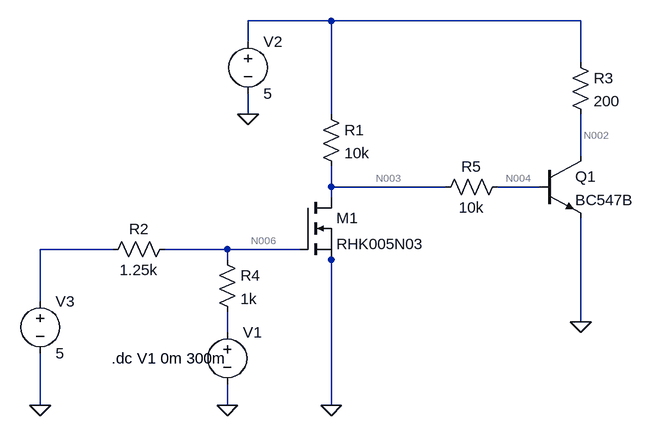
[diagram p0: schematic off_hook_sensor_with_mosfet.asc]
off_hook_sensor_with_mosfet.asc, the LTspice schematic file:
Version 4
SHEET 1 880 680
WIRE 160 -160 32 -160
WIRE 544 -160 160 -160
WIRE 32 -128 32 -160
WIRE 544 -96 544 -160
WIRE 32 -16 32 -48
WIRE 160 -16 160 -160
WIRE 544 48 544 -16
WIRE 160 96 160 64
WIRE 336 96 160 96
WIRE 480 96 416 96
WIRE 160 112 160 96
WIRE -176 192 -288 192
WIRE 0 192 -96 192
WIRE 112 192 0 192
WIRE 0 208 0 192
WIRE 160 208 160 192
WIRE -288 272 -288 192
WIRE 544 304 544 144
WIRE 0 320 0 288
WIRE -288 432 -288 352
WIRE 0 432 0 400
WIRE 160 432 160 208
FLAG 160 432 0
FLAG 32 -16 0
FLAG -288 432 0
FLAG 0 432 0
FLAG 544 304 0
SYMBOL nmos 112 112 R0
SYMATTR InstName M1
SYMATTR Value RHK005N03
SYMBOL voltage 0 304 R0
WINDOW 3 27 101 Left 2
WINDOW 123 0 0 Left 0
WINDOW 39 0 0 Left 0
SYMATTR InstName V1
SYMATTR Value ""
SYMBOL voltage 32 -144 R0
WINDOW 123 0 0 Left 0
WINDOW 39 0 0 Left 0
SYMATTR InstName V2
SYMATTR Value 5
SYMBOL res 144 -32 R0
SYMATTR InstName R1
SYMATTR Value 10k
SYMBOL voltage -288 256 R0
WINDOW 123 0 0 Left 0
WINDOW 39 0 0 Left 0
SYMATTR InstName V3
SYMATTR Value 5
SYMBOL res -80 176 R90
WINDOW 0 0 56 VBottom 2
WINDOW 3 32 56 VTop 2
SYMATTR InstName R2
SYMATTR Value 1.25k
SYMBOL res -16 192 R0
SYMATTR InstName R4
SYMATTR Value 1k
SYMBOL npn 480 48 R0
SYMATTR InstName Q1
SYMATTR Value BC547B
SYMBOL res 528 -112 R0
SYMATTR InstName R3
SYMATTR Value 200
SYMBOL res 432 80 R90
WINDOW 0 0 56 VBottom 2
WINDOW 3 32 56 VTop 2
SYMATTR InstName R5
SYMATTR Value 10k
TEXT -178 360 Left 2 !.dc V1 0m 300m

The netlist it stands for:
* off_hook_sensor_with_mosfet.asc
M1 N003 N006 0 0 RHK005N03
V1 N007 0
V2 N001 0 5
R1 N001 N003 10k
V3 N005 0 5
R2 N006 N005 1.25k
R4 N006 N007 1k
Q1 N002 N004 0 0 BC547B
R3 N001 N002 200
R5 N004 N003 10k
.model NPN NPN
.model PNP PNP
.lib standard.bjt
.model NMOS NMOS
.model PMOS PMOS
.lib standard.mos
.dc V1 0m 300m
.backanno
.end

* Results of the author's LTspice run, read from the files saved beside the schematic
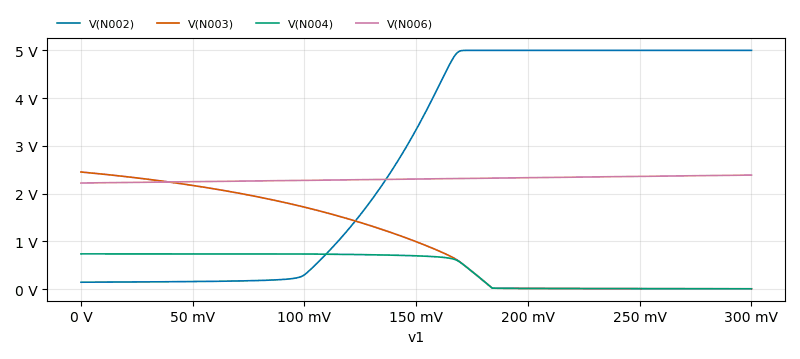
[diagram p1: DC transfer characteristic of off_hook_sensor_with_mosfet.asc, plotted from the saved traces]
* DC transfer characteristic, 1 run:
*   V(N002): 145.3 mV at v1=0 V, 5 V at v1=300 mV, min 145.3 mV, max 5 V
*   V(N003): 2.453 V at v1=0 V, 7.122 mV at v1=300 mV, min 7.122 mV, max 2.453 V
*   V(N004): 738.5 mV at v1=0 V, 7.122 mV at v1=300 mV, min 7.122 mV, max 738.5 mV
*   V(N006): 2.222 V at v1=0 V, 2.389 V at v1=300 mV, min 2.222 V, max 2.389 V